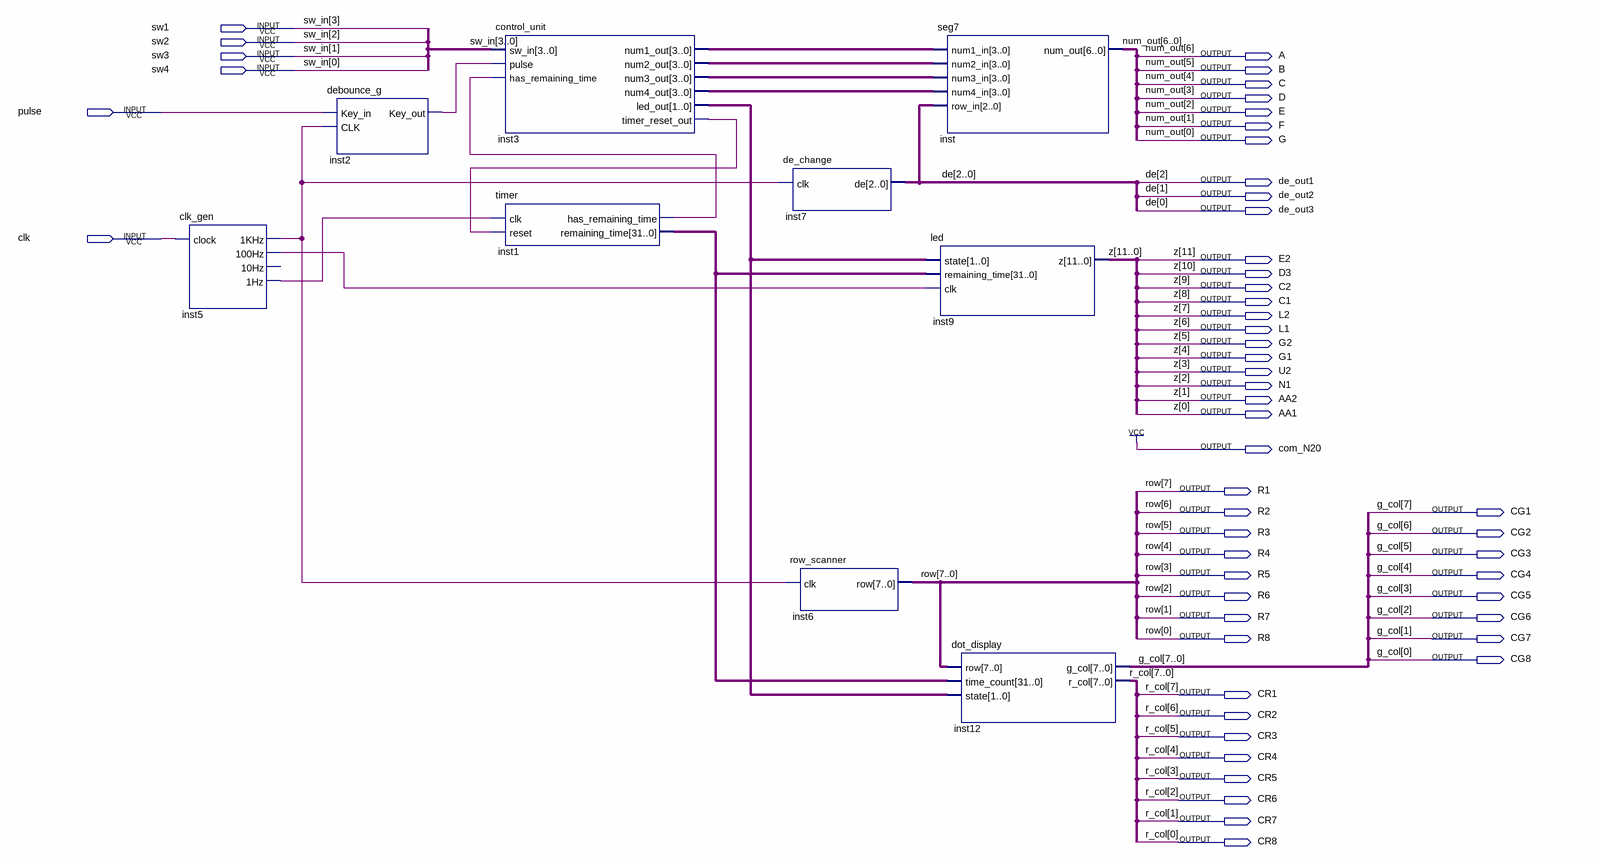
[diagram p0: schematic sheet]
// Quartus schematic key_input.bdf as structural Verilog: 9 symbols, 53 pins
module key_input (
  input  sw1,
  input  sw2,
  input  sw3,
  input  sw4,
  input  pulse,
  input  clk,
  output A,
  output B,
  output C,
  output D,
  output E,
  output F,
  output G,
  output de_out1,
  output de_out2,
  output de_out3,
  output E2,
  output D3,
  output C2,
  output C1,
  output L2,
  output L1,
  output G2,
  output G1,
  output U2,
  output N1,
  output AA2,
  output AA1,
  output com_N20,
  output R1,
  output R2,
  output CG1,
  output R3,
  output CG2,
  output R4,
  output CG3,
  output R5,
  output CG4,
  output R6,
  output CG5,
  output R7,
  output CG6,
  output R8,
  output CG7,
  output CG8,
  output CR1,
  output CR2,
  output CR3,
  output CR4,
  output CR5,
  output CR6,
  output CR7,
  output CR8
);

  wire inst1_has_remaining_time, inst2_key_out, inst3_timer_reset_out, inst5_1hz, inst5_1khz, inst5_100hz;
  wire [1:0] inst3_led_out;
  wire [3:0] inst3_num1_out, inst3_num2_out, inst3_num3_out, inst3_num4_out;
  wire [31:0] inst1_remaining_time;

  clk_gen inst5 (.clock(clk), .\1KHz (inst5_1khz), .\100Hz (inst5_100hz), .\1Hz (inst5_1hz));  // open: 10Hz
  debounce_g inst2 (.Key_in(pulse), .CLK(inst5_1khz), .Key_out(inst2_key_out));
  control_unit inst3 (
    .sw_in({sw1, sw2, sw3, sw4}), .pulse(inst2_key_out), .has_remaining_time(inst1_has_remaining_time),
    .num1_out(inst3_num1_out), .num2_out(inst3_num2_out), .num3_out(inst3_num3_out),
    .num4_out(inst3_num4_out), .led_out(inst3_led_out), .timer_reset_out(inst3_timer_reset_out));
  timer inst1 (
    .clk(inst5_1hz), .reset(inst3_timer_reset_out), .has_remaining_time(inst1_has_remaining_time),
    .remaining_time(inst1_remaining_time));
  de_change inst7 (.clk(inst5_1khz), .de({de_out1, de_out2, de_out3}));
  row_scanner inst6 (.clk(inst5_1khz), .row({R1, R2, R3, R4, R5, R6, R7, R8}));
  seg7 inst (
    .num1_in(inst3_num1_out), .num2_in(inst3_num2_out), .num3_in(inst3_num3_out), .num4_in(inst3_num4_out),
    .row_in({de_out1, de_out2, de_out3}), .num_out({A, B, C, D, E, F, G}));
  led inst9 (
    .state(inst3_led_out), .remaining_time(inst1_remaining_time), .clk(inst5_100hz),
    .z({E2, D3, C2, C1, L2, L1, G2, G1, U2, N1, AA2, AA1}));
  dot_display inst12 (
    .row({R1, R2, R3, R4, R5, R6, R7, R8}), .time_count(inst1_remaining_time), .state(inst3_led_out),
    .g_col({CG1, CG2, CG3, CG4, CG5, CG6, CG7, CG8}), .r_col({CR1, CR2, CR3, CR4, CR5, CR6, CR7, CR8}));

  assign com_N20 = 1'b1;

  // Other names for the same wires on the sheet: de[2:0] = {de_out1, de_out2, de_out3};
  //   g_col[7:0] = {CG1, CG2, CG3, CG4, CG5, CG6, CG7, CG8}; num_out[6:0] = {A, B, C, D, E, F, G};
  //   r_col[7:0] = {CR1, CR2, CR3, CR4, CR5, CR6, CR7, CR8}; row[7:0] = {R1, R2, R3, R4, R5, R6, R7, R8};
  //   sw_in[3:0] = {sw1, sw2, sw3, sw4}; z[11:0] = {E2, D3, C2, C1, L2, L1, G2, G1, U2, N1, AA2, AA1}
endmodule
